# Altium schematic sheet Teensy.SchDoc
size A2; Organization: Altium Limited; Address1: L3, 12a Rodborough Rd; Address2: Frenchs Forest; Address3: NSW; Address4: Australia 2086
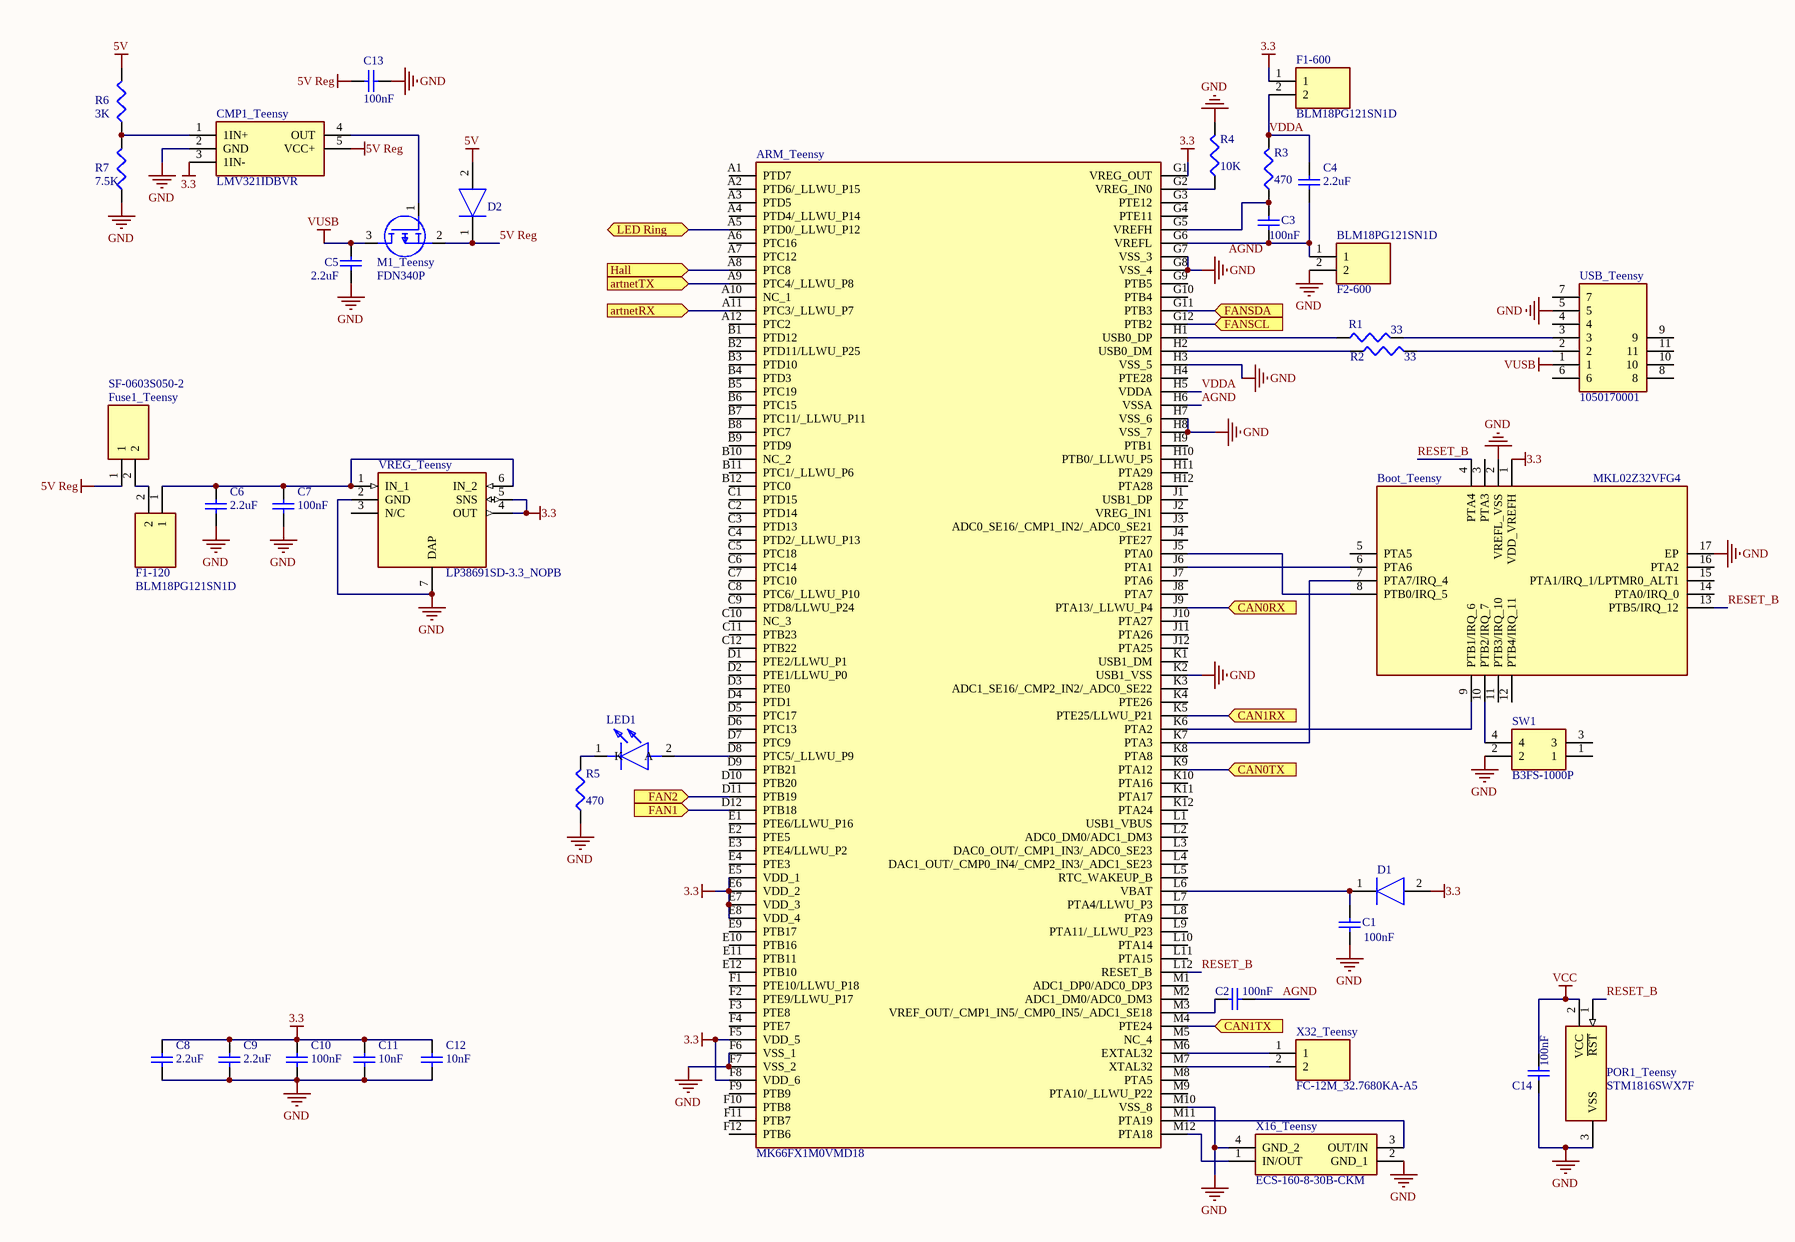
[diagram p0: Teensy.SchDoc]

## Parts
ARM_Teensy  MK66FX1M0VMD18  [BGA144C100P12X12_1300X1300X170]
Boot_Teensy  MKL02Z32VFG4  [QFN50P300X300X65-17N-D]
C1  value 100nF  [1608[0603]]  (hidden comment: Cap Semi)
C2  value 100nF  [1608[0603]]  (hidden comment: Cap Semi)
C3  value 100nF  [1608[0603]]  (hidden comment: Cap Semi)
C4  value 2.2uF  [1608[0603]]  (hidden comment: Cap Semi)
C5  value 2.2uF  [1608[0603]]  (hidden comment: Cap Semi)
C6  value 2.2uF  [1608[0603]]  (hidden comment: Cap Semi)
C7  value 100nF  [1608[0603]]  (hidden comment: Cap Semi)
C8  value 2.2uF  [1608[0603]]  (hidden comment: Cap Semi)
C9  value 2.2uF  [1608[0603]]  (hidden comment: Cap Semi)
C10  value 100nF  [1608[0603]]  (hidden comment: Cap Semi)
C11  value 10nF  [1608[0603]]  (hidden comment: Cap Semi)
C12  value 10nF  [1608[0603]]  (hidden comment: Cap Semi)
C13  value 100nF  [1608[0603]]  (hidden comment: Cap Semi)
C14  value 100nF  [1608[0603]]  (hidden comment: Cap Semi)
CMP1_Teensy  LMV321IDBVR  [SOT95P280X145-5N]
D1  NRVTS260ESFT1G  [SODFL3616X98N]  (value not drawn)
D2  NRVTS260ESFT1G  [SODFL3616X98N]  (value not drawn)
F1-120  BLM18PG121SN1D  [BEADC1608X95N]
F1-600  BLM18PG121SN1D  [BEADC1608X95N]
F2-600  BLM18PG121SN1D  [BEADC1608X95N]
Fuse1_Teensy  SF-0603S050-2  [FUSC1608X55N]
LED1  HSMC-C190  [LEDC1608X90N]  (value not drawn)
M1_Teensy  FDN340P  [SOT95P237X112-3N]
POR1_Teensy  STM1816SWX7F  [SOT103P237X112-3N]
R1  value 33  [J1-0603]  (hidden comment: Res3)
R2  value 33  [J1-0603]  (hidden comment: Res3)
R3  value 470  [J1-0603]  (hidden comment: Res3)
R4  value 10K  [J1-0603]  (hidden comment: Res3)
R5  value 470  [J1-0603]  (hidden comment: Res3)
R6  value 3K  [J1-0603]  (hidden comment: Res3)
R7  value 7.5K  [J1-0603]  (hidden comment: Res3)
SW1  B3FS-1000P  [B3FS-1000P]
USB_Teensy  1050170001  [MICROUSB-BTYPE]
VREG_Teensy  LP38691SD-3.3_NOPB  [SON95P300X300X80-7N]
X16_Teensy  ECS-160-8-30B-CKM  [ECS801830BAGNTR]
X32_Teensy  FC-12M_32.7680KA-A5  [FC12M327680KAA5]

## Ports
artnetRX, artnetTX, CAN0RX, CAN0TX, CAN1RX, CAN1TX, FAN1, FAN2, FANSCL, FANSDA, Hall, LED Ring

## Nets
3.3: ARM_Teensy.E5(VDD_1) ARM_Teensy.E6(VDD_2) ARM_Teensy.E7(VDD_3) ARM_Teensy.E8(VDD_4) ARM_Teensy.F5(VDD_5) ARM_Teensy.F8(VDD_6) ARM_Teensy.G1(VREG_OUT) Boot_Teensy.1(VDD_VREFH) C8.2 C9.2 C10.2 C11.2 C12.2 CMP1_Teensy.3(1IN-) D1.2(A) F1-600.1 VREG_Teensy.4(OUT) VREG_Teensy.5(SNS)
5V: D2.2(A) R6.2
5V Reg: C13.2 CMP1_Teensy.5(VCC+) D2.1(K) Fuse1_Teensy.1 M1_Teensy.2(S)
GND: ARM_Teensy.F6(VSS_1) ARM_Teensy.F7(VSS_2) ARM_Teensy.G7(VSS_3) ARM_Teensy.G8(VSS_4) ARM_Teensy.H3(VSS_5) ARM_Teensy.H7(VSS_6) ARM_Teensy.H8(VSS_7) ARM_Teensy.K2(USB1_VSS) ARM_Teensy.M10(VSS_8) Boot_Teensy.2(VREFL_VSS) Boot_Teensy.17(EP) C1.1 C5.2 C6.1 C7.1 C8.1 C9.1 C10.1 C11.1 C12.1 C13.1 C14.1 CMP1_Teensy.2(GND) F2-600.2 POR1_Teensy.3(VSS) R4.2 R5.1 R7.1 SW1.2 USB_Teensy.5 VREG_Teensy.2(GND) VREG_Teensy.7(DAP) X16_Teensy.2(GND_1) X16_Teensy.4(GND_2)
VCC: C14.2 POR1_Teensy.2(VCC)
VUSB: C5.1 M1_Teensy.3(D) USB_Teensy.1
AGND: ARM_Teensy.H6(VSSA) C2.2
artnetRX: ARM_Teensy.A11(PTC3/_LLWU_P7) ; port artnetRX
artnetTX: ARM_Teensy.A9(PTC4/_LLWU_P8) ; port artnetTX
CAN0RX: ARM_Teensy.J9(PTA13/_LLWU_P4) ; port CAN0RX
CAN0TX: ARM_Teensy.K9(PTA12) ; port CAN0TX
CAN1RX: ARM_Teensy.K5(PTE25/LLWU_P21) ; port CAN1RX
CAN1TX: ARM_Teensy.M4(PTE24) ; port CAN1TX
FAN1: ARM_Teensy.D12(PTB18) ; port FAN1
FAN2: ARM_Teensy.D11(PTB19) ; port FAN2
FANSCL: ARM_Teensy.G12(PTB2) ; port FANSCL
FANSDA: ARM_Teensy.G11(PTB3) ; port FANSDA
Hall: ARM_Teensy.A8(PTC8) ; port Hall
LED Ring: ARM_Teensy.A5(PTD0/_LLWU_P12) ; port LED Ring
RESET_B: ARM_Teensy.L12(RESET_B) Boot_Teensy.4(PTA4) Boot_Teensy.13(PTB5/IRQ_12) POR1_Teensy.1(~{RST})
VDDA: ARM_Teensy.H5(VDDA) C4.2 F1-600.2 R3.2
NetARM_Teensy_D8: ARM_Teensy.D8(PTC5/_LLWU_P9) LED1.2(A)
NetARM_Teensy_G2: ARM_Teensy.G2(VREG_IN0) R4.1
NetARM_Teensy_G5: ARM_Teensy.G5(VREFH) C3.2 R3.1
NetARM_Teensy_G6: ARM_Teensy.G6(VREFL) C3.1 C4.1 F2-600.1
NetARM_Teensy_H1: ARM_Teensy.H1(USB0_DP) R1.1
NetARM_Teensy_H2: ARM_Teensy.H2(USB0_DM) R2.1
NetARM_Teensy_J5: ARM_Teensy.J5(PTA0) Boot_Teensy.8(PTB0/IRQ_5)
NetARM_Teensy_J6: ARM_Teensy.J6(PTA1) Boot_Teensy.6(PTA6)
NetARM_Teensy_K6: ARM_Teensy.K6(PTA2) Boot_Teensy.9(PTB1/IRQ_6)
NetARM_Teensy_K7: ARM_Teensy.K7(PTA3) Boot_Teensy.7(PTA7/IRQ_4)
NetARM_Teensy_L6: ARM_Teensy.L6(VBAT) C1.2 D1.1(K)
NetARM_Teensy_M3: ARM_Teensy.M3(VREF_OUT/_CMP1_IN5/_CMP0_IN5/_ADC1_SE18) C2.1
NetARM_Teensy_M6: ARM_Teensy.M6(EXTAL32) X32_Teensy.1
NetARM_Teensy_M7: ARM_Teensy.M7(XTAL32) X32_Teensy.2
NetARM_Teensy_M11: ARM_Teensy.M11(PTA19) X16_Teensy.3(OUT/IN)
NetARM_Teensy_M12: ARM_Teensy.M12(PTA18) X16_Teensy.1(IN/OUT)
NetBoot_Teensy_10: Boot_Teensy.10(PTB2/IRQ_7) SW1.4
NetC6_2: C6.2 C7.2 F1-120.1 VREG_Teensy.1(IN_1) VREG_Teensy.6(IN_2)
NetCMP1_Teensy_1: CMP1_Teensy.1(1IN+) R6.1 R7.2
NetCMP1_Teensy_4: CMP1_Teensy.4(OUT) M1_Teensy.1(G)
NetF1-120_2: F1-120.2 Fuse1_Teensy.2
NetLED1_1: LED1.1(K) R5.2
NetR1_2: R1.2 USB_Teensy.3
NetR2_2: R2.2 USB_Teensy.2

Not connected (* = marked no-connect by the designer): ARM_Teensy A1(PTD7) A2(PTD6/_LLWU_P15) A3(PTD5) A4(PTD4/_LLWU_P14) A6(PTC16) A7(PTC12) A10(NC_1) A12(PTC2) B1(PTD12) B2(PTD11/LLWU_P25) B3(PTD10) B4(PTD3) B5(PTC19) B6(PTC15) B7(PTC11/_LLWU_P11) B8(PTC7) B9(PTD9) B10(NC_2) B11(PTC1/_LLWU_P6) B12(PTC0) C1(PTD15) C2(PTD14) C3(PTD13) C4(PTD2/_LLWU_P13) C5(PTC18) C6(PTC14) C7(PTC10) C8(PTC6/_LLWU_P10) C9(PTD8/LLWU_P24) C10(NC_3) C11(PTB23) C12(PTB22) D1(PTE2/LLWU_P1) D2(PTE1/LLWU_P0) D3(PTE0) D4(PTD1) D5(PTC17) D6(PTC13) D7(PTC9) D9(PTB21) D10(PTB20) E1(PTE6/LLWU_P16) E2(PTE5) E3(PTE4/LLWU_P2) E4(PTE3) E9(PTB17) E10(PTB16) E11(PTB11) E12(PTB10) F1(PTE10/LLWU_P18) F2(PTE9/LLWU_P17) F3(PTE8) F4(PTE7) F9(PTB9) F10(PTB8) F11(PTB7) F12(PTB6) G3(PTE12) G4(PTE11) G9(PTB5) G10(PTB4) H4(PTE28) H9(PTB1) H10(PTB0/_LLWU_P5) H11(PTA29) H12(PTA28) J1(USB1_DP) J2(VREG_IN1) J3(ADC0_SE16/_CMP1_IN2/_ADC0_SE21) J4(PTE27) J7(PTA6) J8(PTA7) J10(PTA27) J11(PTA26) J12(PTA25) K1(USB1_DM) K3(ADC1_SE16/_CMP2_IN2/_ADC0_SE22) K4(PTE26) K8(PTA8) K10(PTA16) K11(PTA17) K12(PTA24) L1(USB1_VBUS) L2(ADC0_DM0/ADC1_DM3) L3(DAC0_OUT/_CMP1_IN3/_ADC0_SE23) L4(DAC1_OUT/_CMP0_IN4/_CMP2_IN3/_ADC1_SE23) L5(RTC_WAKEUP_B) L7(PTA4/LLWU_P3) L8(PTA9) L9(PTA11/_LLWU_P23) L10(PTA14) L11(PTA15) M1(ADC1_DP0/ADC0_DP3) M2(ADC1_DM0/ADC0_DM3) M5(NC_4) M8(PTA5) M9(PTA10/_LLWU_P22); Boot_Teensy 3(PTA3) 5(PTA5) 11(PTB3/IRQ_10) 12(PTB4/IRQ_11) 14(PTA0/IRQ_0) 15(PTA1/IRQ_1/LPTMR0_ALT1) 16(PTA2); SW1 1 3; USB_Teensy 4 6 7 8 9 10 11; VREG_Teensy 3(N/C)

## Notes on the sheet
- Labels drawn without touching a wire or pin: AGND
- Title
- Size:
- Date:
- File:
- A2
- Number:
- Time:
- Revision:
- Sheet
- of

## Library data of the parts
ARM_Teensy = MK66FX1M0VMD18: Integrated Circuit; Manufacturer_Name: Nexperia; Datasheet Link: https://componentsearchengine.com/Datasheets/2/MK66FX1M0VMD18.pdf; Height: 1.7mm; Manufacturer_Part_Number: MK66FX1M0VMD18; Mouser Part Number: 841-MK66FX1M0VMD18; Mouser Price/Stock: https://www.mouser.com/Search/Refine.aspx?Keyword=841-MK66FX1M0VMD18
Boot_Teensy = MKL02Z32VFG4: Integrated Circuit; Manufacturer_Name: Nexperia; Datasheet Link: https://www.nxp.com/docs/en/data-sheet/KL02P32M48SF0.pdf; Height: 0.65mm; Manufacturer_Part_Number: MKL02Z32VFG4; Mouser Part Number: 841-MKL02Z32VFG4; Mouser Price/Stock: https://www.mouser.com/Search/Refine.aspx?Keyword=841-MKL02Z32VFG4; RS Part Number: 7884723P; RS Price/Stock: http://uk.rs-online.com/web/p/products/7884723P
C1-C14 = Cap Semi: Capacitor (Semiconductor SIM Model); Published: 8-Jun-2000; LatestRevisionDate: 29-May-2009; LatestRevisionNote: IPC-7351 Footprint Added.; PackageReference: C1206; Publisher: Altium Limited; PackageDescription: Chip Capacitor
CMP1_Teensy = LMV321IDBVR: Integrated Circuit; Manufacturer_Name: Texas Instruments; Datasheet Link: http://www.ti.com/lit/gpn/lmv321; Height: 1.45mm; Manufacturer_Part_Number: LMV321IDBVR; Mouser Part Number: 595-LMV321IDBVR; Mouser Price/Stock: https://www.mouser.com/Search/Refine.aspx?Keyword=595-LMV321IDBVR
D1 D2 = NRVTS260ESFT1G: Diode; Manufacturer_Name: ON Semiconductor; Allied_Number: 70600214; Datasheet Link: http://www.onsemi.com/pub/Collateral/NTS260ESF-D.PDF; Height: 0.98mm; Manufacturer_Part_Number: NRVTS260ESFT1G; Mouser Part Number: 863-NRVTS260ESFT1G; Mouser Price/Stock: https://www.mouser.com/Search/Refine.aspx?Keyword=863-NRVTS260ESFT1G; RS Part Number: 8673243P; RS Price/Stock: http://uk.rs-online.com/web/p/products/8673243P; Allied Price/Stock: http://www.alliedelec.com/on-semiconductor-nrvts260esft1g/70600214/
F1-120 F1-600 F2-600 = BLM18PG121SN1D: Filter; Manufacturer_Name: Murata Electronics; Datasheet Link: https://www.murata.com/en-us/products/productdetail?partno=BLM18PG121SN1%23; Height: 0.95mm; Manufacturer_Part_Number: BLM18PG121SN1D; Mouser Part Number: 81-BLM18PG121SN1D; Mouser Price/Stock: https://www.mouser.com/Search/Refine.aspx?Keyword=81-BLM18PG121SN1D; RS Part Number: 7241380P; RS Price/Stock: http://uk.rs-online.com/web/p/products/7241380P
Fuse1_Teensy = SF-0603S050-2: Fuse; Manufacturer_Name: Bourns; Allied_Number: 71279504; Datasheet Link: https://www.bourns.com/docs/Product-Datasheets/sf0603s.pdf; Height: 0.55mm; Manufacturer_Part_Number: SF-0603S050-2; Mouser Part Number: 652-SF-0603S050-2; Mouser Price/Stock: https://www.mouser.com/Search/Refine.aspx?Keyword=652-SF-0603S050-2; RS Part Number: 8978989P; RS Price/Stock: http://uk.rs-online.com/web/p/products/8978989P; Allied Price/Stock: https://www.alliedelec.com/bourns-sf-0603s050-2/71279504/
LED1 = HSMC-C190: LED; Manufacturer_Name: Avago Technologies; Datasheet Link: http://www.mouser.hk/ProductDetail/Broadcom-Avago/HSMC-C190/?qs=YDL0qNrpDT4TTmzDJNXHWQ==; Height: 0.9mm; Manufacturer_Part_Number: HSMC-C190; Mouser Part Number: 630-HSMC-C190; Mouser Price/Stock: https://www.mouser.com/Search/Refine.aspx?Keyword=630-HSMC-C190; RS Part Number: 6910391P; RS Price/Stock: http://uk.rs-online.com/web/p/products/6910391P
M1_Teensy = FDN340P: MOSFET (P-Channel); Manufacturer_Name: ON Semiconductor; Datasheet Link: https://www.onsemi.com/pub/Collateral/FDN340P-D.PDF; Height: 1.12mm; Manufacturer_Part_Number: FDN340P; Mouser Part Number: 512-FDN340P; Mouser Price/Stock: https://www.mouser.com/Search/Refine.aspx?Keyword=512-FDN340P; RS Part Number: 6710435P; RS Price/Stock: http://uk.rs-online.com/web/p/products/6710435P
POR1_Teensy = STM1816SWX7F: Integrated Circuit; Manufacturer_Name: STMicroelectronics; Allied_Number: 70014047; Datasheet Link: http://www.st.com/st-web-ui/static/active/en/resource/technical/document/datasheet/CD00059921.pdf; Height: 1.12mm; Manufacturer_Part_Number: STM1816SWX7F; Mouser Part Number: 511-STM1816SWX7F; Mouser Price/Stock: https://www.mouser.com/Search/Refine.aspx?Keyword=511-STM1816SWX7F; RS Part Number: 6248264; RS Price/Stock: http://uk.rs-online.com/web/p/products/6248264; Allied Price/Stock: http://www.alliedelec.com/stmicroelectronics-stm1816swx7f/70014047/
R1-R7 = Res3: Resistor; Published: 8-Jun-2000; LatestRevisionDate: 29-May-2009; LatestRevisionNote: IPC-7351 Footprint Added.; PackageReference: J1-0603; Publisher: Altium Limited; PackageDescription: Chip Resistor
SW1 = B3FS-1000P: Switch; Manufacturer_Name: Omron Electronics; Allied_Number: 70175891; Datasheet Link: https://www.omron.co.jp/ecb/products/pdf/b3fs.pdf; Manufacturer_Part_Number: B3FS-1000P; Mouser Part Number: 653-B3FS-1000P; Mouser Price/Stock: https://www.mouser.com/Search/Refine.aspx?Keyword=653-B3FS-1000P; RS Part Number: 6821254P; RS Price/Stock: http://uk.rs-online.com/web/p/products/6821254P; Allied Price/Stock: http://www.alliedelec.com/omron-electronic-components-b3fs-1000p/70175891/
USB_Teensy = 1050170001: Connector; Manufacturer_Name: Molex; Datasheet Link: http://www.mouser.com/ds/2/276/1050170001_IO_CONNECTORS-230168.pdf; Manufacturer_Part_Number: 1050170001; Mouser Part Number: N/A; Mouser Price/Stock: https://www.mouser.com/Search/Refine.aspx?Keyword=N%2FA
VREG_Teensy = LP38691SD-3.3_NOPB: Power Supply; Manufacturer_Name: Texas Instruments; Manufacturer_Part_Number: LP38691SD-3.3/NOPB; Datasheet Link: http://www.ti.com/lit/ds/symlink/lp38693-q1.pdf; Height: 0.8mm; Mouser Part Number: 926-38691SD-3.3/NOPB; Mouser Price/Stock: https://www.mouser.com/Search/Refine.aspx?Keyword=926-38691SD-3.3%2FNOPB; RS Part Number: 7616605P; RS Price/Stock: http://uk.rs-online.com/web/p/products/7616605P
X16_Teensy = ECS-160-8-30B-CKM: Crystal or Oscillator; Manufacturer_Name: ECS; Datasheet Link: https://ecsxtal.com/store/pdf/ecx_53b.pdf; Height: 0.85mm; Manufacturer_Part_Number: ECS-160-8-30B-CKM; Mouser Part Number: 520-160-8-30B-CKM; Mouser Price/Stock: https://www.mouser.com/Search/Refine.aspx?Keyword=520-160-8-30B-CKM
X32_Teensy = FC-12M_32.7680KA-A5: Crystal or Oscillator; Manufacturer_Name: Epson Timing; Manufacturer_Part_Number: FC-12M 32.7680KA-A5; Datasheet Link: https://support.epson.biz/td/api/doc_check.php?dl=brief_FC-12D&lang=en; Height: 0.6mm; Mouser Part Number: 732-FC-12M32.768KAA5; Mouser Price/Stock: https://www.mouser.com/Search/Refine.aspx?Keyword=732-FC-12M32.768KAA5